# EAGLE design mylcdwithencoder-ramps14-interface-pcb (EAGLE 6.5.0)
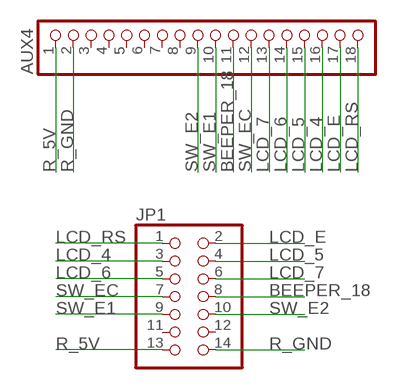
[diagram p0: schematic, sheet 1]

## Parts
AUX4  PINHD-1X18  [1X18]
JP1  PINHD-2X7  [2X07]

## Nets
BEEPER_18: AUX4.11 JP1.8
LCD_4: AUX4.16 JP1.3
LCD_5: AUX4.15 JP1.4
LCD_6: AUX4.14 JP1.5
LCD_7: AUX4.13 JP1.6
LCD_E: AUX4.17 JP1.2
LCD_RS: AUX4.18 JP1.1
R_5V: AUX4.1 JP1.13
R_GND: AUX4.2 JP1.14
SW_E1: AUX4.10 JP1.9
SW_E2: AUX4.9 JP1.10
SW_EC: AUX4.12 JP1.7
Unconnected: AUX4.3 AUX4.4 AUX4.5 AUX4.6 AUX4.7 AUX4.8 JP1.11 JP1.12

## Library data of the parts
AUX4 = pinhead:PINHD-1X18: PIN HEADER
JP1 = pinhead:PINHD-2X7: PIN HEADER

## Board
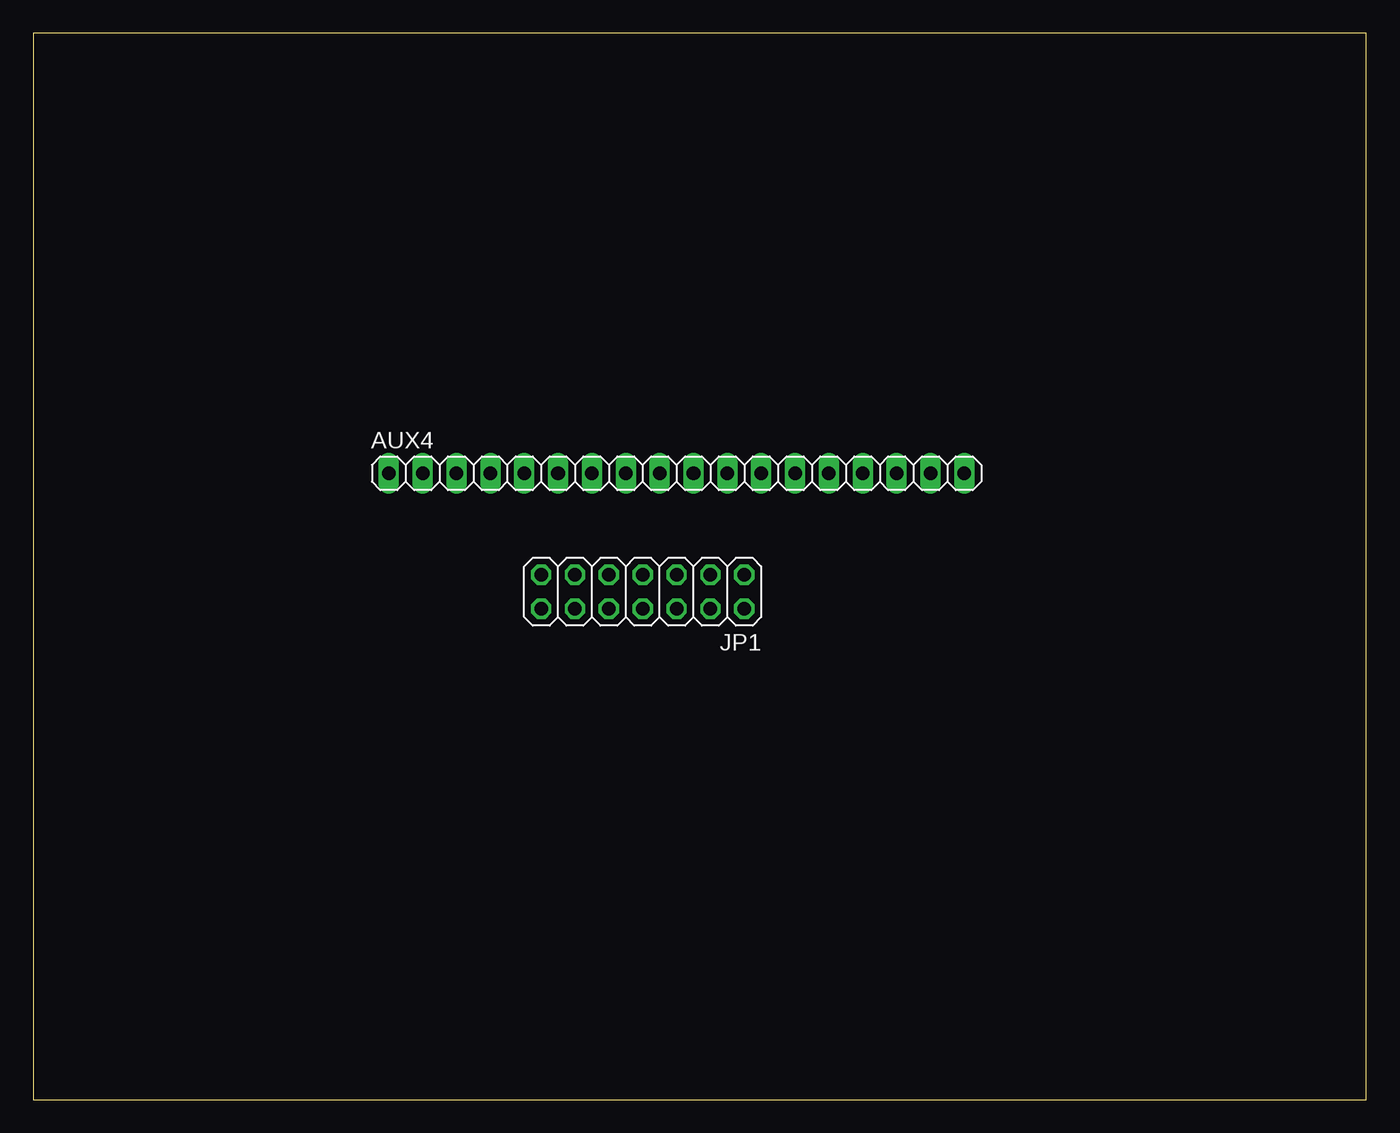
[diagram p1: board, top side]
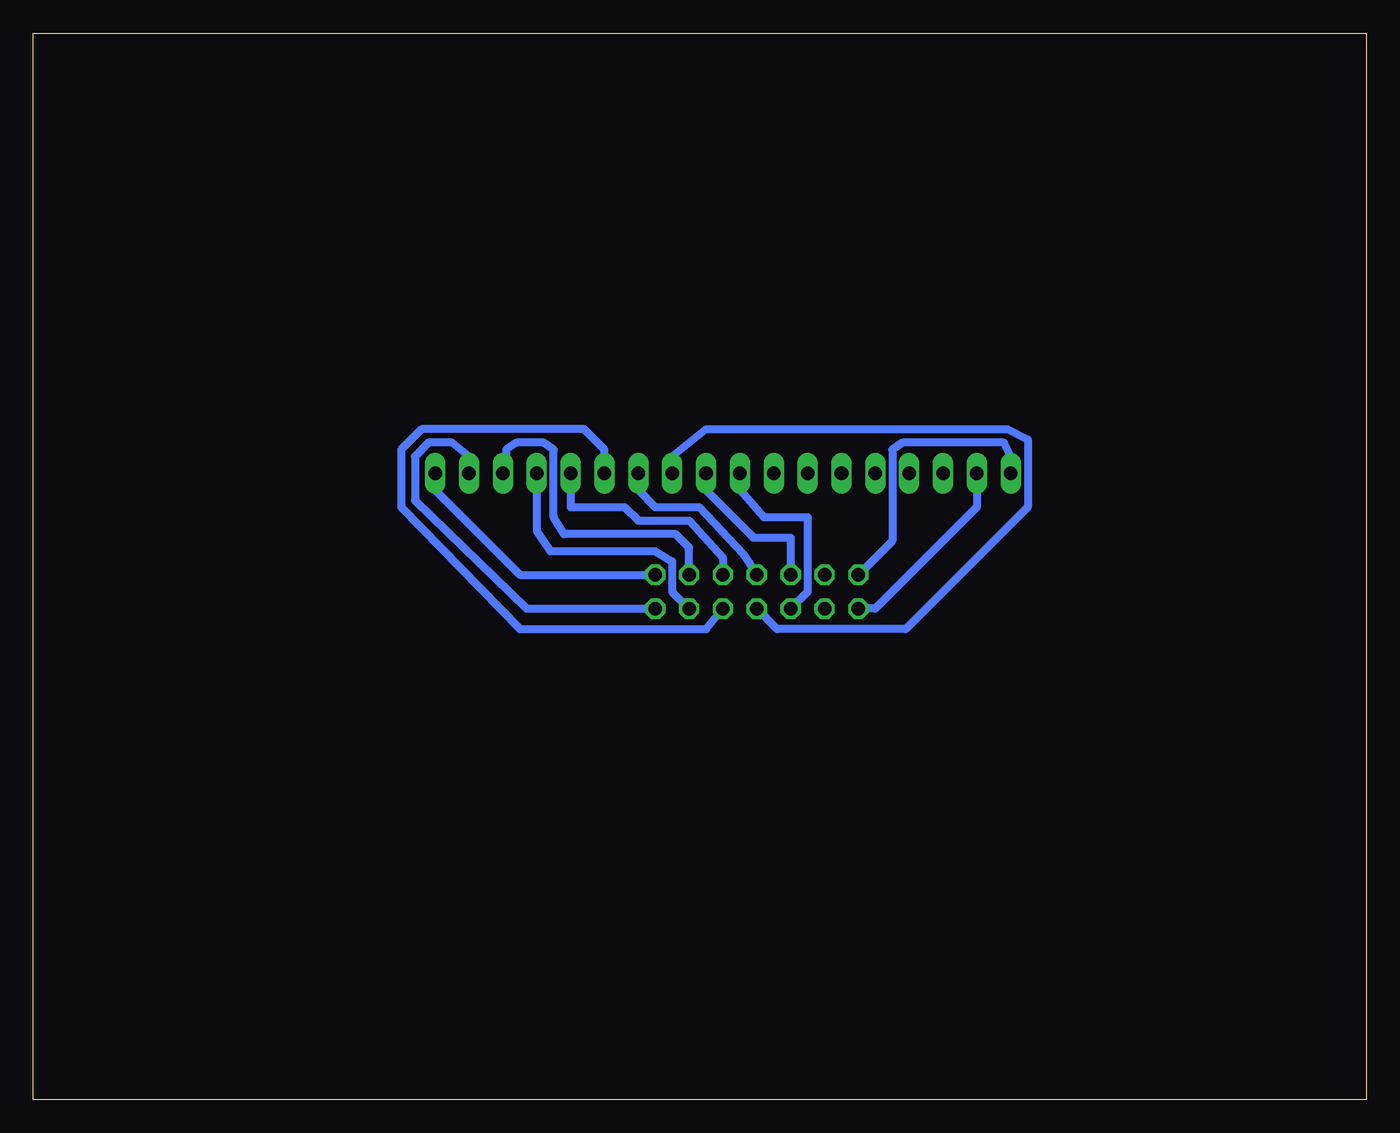
[diagram p2: board, bottom side, seen from below]

Size 100 x 80 mm. Coordinates in mm from the lower left corner, seen from the top.
Outline: 0,0 100,0 100,80 0,80 0,0
Copper layers (1*16): Top 0.035mm / dielectric 1.5mm / Bottom 0.035mm
Design rules "default *": minimum track width 24mil, minimum drill 24mil, track to track 8mil, track to pad 8mil, pad to pad 8mil, via to via 8mil, smd to smd 8mil, copper to edge 40mil, drill to drill 8mil, minimum pad ring 10mil, minimum via ring 8mil, stop-mask expansion 4mil, vias tented up to drill 0mil, thermal gap 10mil

### Footprints (pad centres in the part's own frame; a part is rotated, then mirrored left to right if it is on the bottom)
1X18 = drill 1.016 long: 1 -21.59,0; 2 -19.05,0; 3 -16.51,0; 4 -13.97,0; 5 -11.43,0; 6 -8.89,0; 7 -6.35,0; 8 -3.81,0; 9 -1.27,0; 10 1.27,0; 11 3.81,0; 12 6.35,0; 13 8.89,0; 14 11.43,0; 15 13.97,0; 16 16.51,0; 17 19.05,0; 18 21.59,0
2X07 = drill 1.016 octagon: 1 -7.62,-1.27; 2 -7.62,1.27; 3 -5.08,-1.27; 4 -5.08,1.27; 5 -2.54,-1.27; 6 -2.54,1.27; 7 0,-1.27; 8 0,1.27; 9 2.54,-1.27; 10 2.54,1.27; 11 5.08,-1.27; 12 5.08,1.27; 13 7.62,-1.27; 14 7.62,1.27

### Placement (x,y rotation side)
AUX4  48.26,46.99 0 top
JP1  45.72,38.1 180 top

### Tracks (layer width: path | path; a pad name or v marks a point on that pad's centre or on a via)
BEEPER_18
  Bottom 0.61: JP1.8 44.2,35.31 34.54,35.31 25.4,44.45 25.4,49.53 26.92,50.29 49.53,50.29 52.07,48.26 AUX4.11
LCD_4
  Bottom 0.61: JP1.3 50.8,41.4 51.82,42.42 60.2,42.42 60.96,43.69 60.96,48.77 61.72,49.28 63.75,49.28 64.52,48.77 64.52,47.24 AUX4.16
LCD_5
  Bottom 0.61: JP1.4 52.07,38.1 52.07,40.39 53.34,41.15 61.21,41.15 62.23,42.67 AUX4.15
LCD_6
  Bottom 0.61: JP1.5 48.26,40.64 50.8,43.43 54.61,43.43 55.63,44.45 59.69,44.45 AUX4.14
LCD_7
  Bottom 0.61: JP1.6 49.53,35.31 63.5,35.31 72.39,44.45 72.39,48.77 70.87,50.29 58.67,50.29 57.15,48.77 AUX4.13
LCD_E
  Bottom 0.61: JP1.2 62.99,36.83 71.37,44.96 71.37,48.26 70.36,49.28 68.58,49.28 67.31,48.26 AUX4.17
LCD_RS
  Bottom 0.61: JP1.1 63.5,39.37 69.85,45.72 AUX4.18
R_5V
  Bottom 0.61: AUX4.1 26.67,48.26 27.18,49.28 34.8,49.28 35.56,48.77 35.56,41.91 JP1.13
R_GND
  Bottom 0.61: AUX4.2 29.21,44.45 36.83,36.83 JP1.14
SW_E1
  Bottom 0.61: JP1.9 43.18,42.16 45.97,42.16 49.53,45.72 AUX4.10
SW_E2
  Bottom 0.61: JP1.10 41.91,38.1 41.91,40.64 41.91,43.69 44.96,43.69 45.21,43.69 46.99,45.72 AUX4.9
SW_EC
  Bottom 0.61: JP1.7 46.74,40.89 50.04,44.45 53.34,44.45 54.61,45.72 AUX4.12